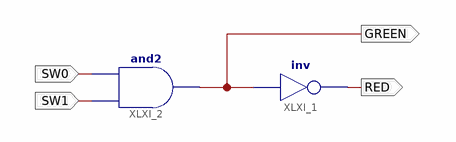
[diagram p0: schematic sheet 1]
// Xilinx ISE schematic Logic.sch (zynq) as structural Verilog: 2 symbols, 4 ports
module Logic (
  input  SW0,
  input  SW1,
  output RED,
  output GREEN
);

  not XLXI_1 (RED, GREEN);
  and XLXI_2 (GREEN, SW1, SW0);
endmodule
